# EAGLE schematic Back (EAGLE 7.6.0)
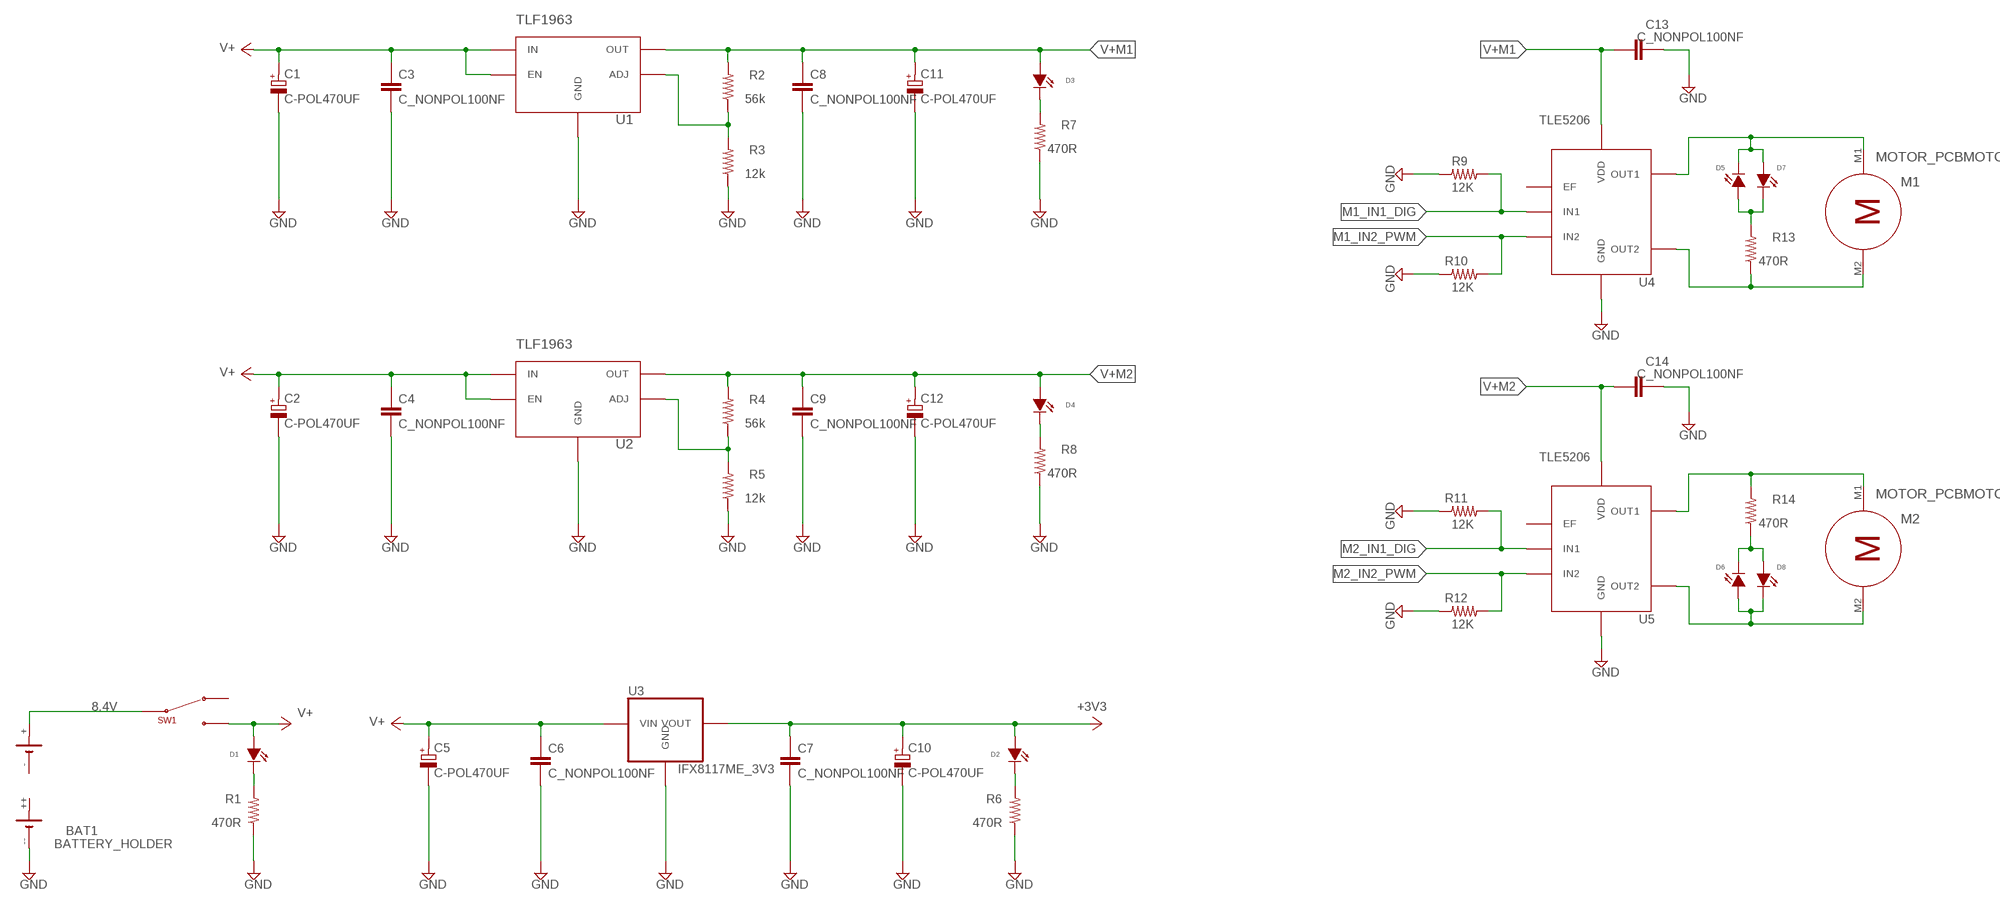
[diagram p0: schematic, sheet 1, part 1 of 2]
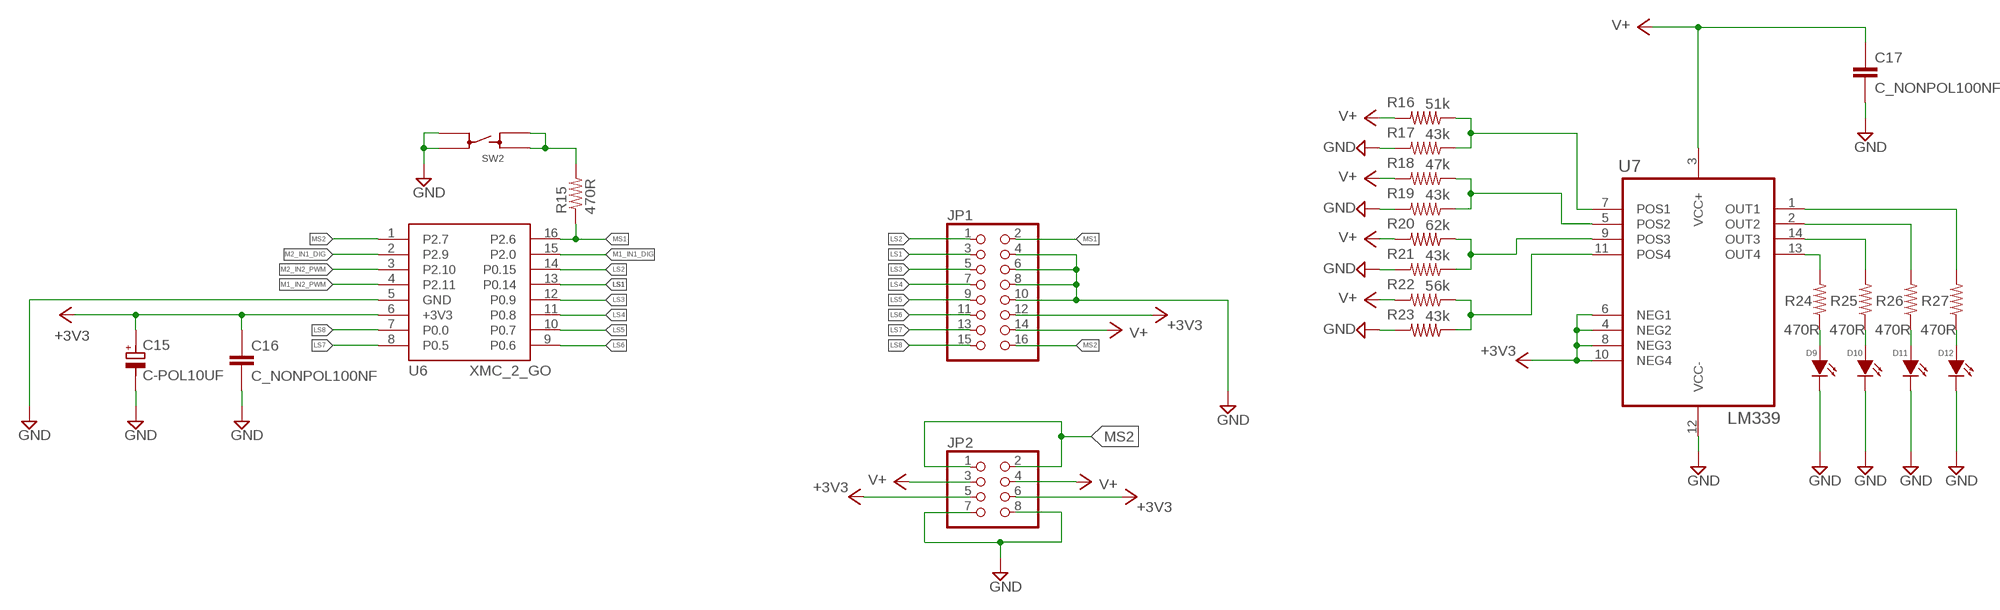
[diagram p1: schematic, sheet 1, part 2 of 2]

## Parts
BAT1  BATTERY_HOLDER  [BATT_SUPPORT_KEYSTONE]
C1  C-POL470UF  [E3,5-8]
C2  C-POL470UF  [E3,5-8]
C3  C_NONPOL100NF  [C1206]
C4  C_NONPOL100NF  [C1206]
C5  C-POL470UF  [E3,5-8]
C6  C_NONPOL100NF  [C1206]
C7  C_NONPOL100NF  [C1206]
C8  C_NONPOL100NF  [C1206]
C9  C_NONPOL100NF  [C1206]
C10  C-POL470UF  [E3,5-8]
C11  C-POL470UF  [E3,5-8]
C12  C-POL470UF  [E3,5-8]
C13  C_NONPOL100NF  [C1206]
C14  C_NONPOL100NF  [C1206]
C15  C-POL10UF  [PANASONIC_B]
C16  C_NONPOL100NF  [C1206]
C17  C_NONPOL100NF  [C1206]
D1  LED  [CHIPLED_1206]
D2  LED  [CHIPLED_1206]
D3  LED  [CHIPLED_1206]
D4  LED  [CHIPLED_1206]
D5  LED  [CHIPLED_1206]
D6  LED  [CHIPLED_1206]
D7  LED  [CHIPLED_1206]
D8  LED  [CHIPLED_1206]
D9  LED  [CHIPLED_1206]
D10  LED  [CHIPLED_1206]
D11  LED  [CHIPLED_1206]
D12  LED  [CHIPLED_1206]
JP1  PINHD-2X8  [2X08]
JP2  PINHD-2X4  [2X04]
M1  MOTOR_PCBMOTOR  [MICRO-MOTOR]
M2  MOTOR_PCBMOTOR  [MICRO-MOTOR]
R1  470R  R1206  [R1206]
R2  56k  R1206  [R1206]
R3  12k  R1206  [R1206]
R4  56k  R1206  [R1206]
R5  12k  R1206  [R1206]
R6  470R  R1206  [R1206]
R7  470R  R1206  [R1206]
R8  470R  R1206  [R1206]
R9  12K  R1206  [R1206]
R10  12K  R1206  [R1206]
R11  12K  R1206  [R1206]
R12  12K  R1206  [R1206]
R13  470R  R1206  [R1206]
R14  470R  R1206  [R1206]
R15  470R  R1206  [R1206]
R16  51k  R1206  [R1206]
R17  43k  R1206  [R1206]
R18  47k  R1206  [R1206]
R19  43k  R1206  [R1206]
R20  62k  R1206  [R1206]
R21  43k  R1206  [R1206]
R22  56k  R1206  [R1206]
R23  43k  R1206  [R1206]
R24  470R  R1206  [R1206]
R25  470R  R1206  [R1206]
R26  470R  R1206  [R1206]
R27  470R  R1206  [R1206]
SW1  SWITCH1OFF2  [MS111]
SW2  PUSH_BUTTON_SMD  [SWPB_SMD]
U1  TLF1963  [INF-PG-TO252-5-11_L_1PRIMARY]
U2  TLF1963  [INF-PG-TO252-5-11_L_1PRIMARY]
U3  IFX8117ME_3V3  [INF-PG-SOT223_SC-73_M_1PRIMARY]
U4  TLE5206  [INF-PG-TO263-7-1_L_1PRIMARY]
U5  TLE5206  [INF-PG-TO263-7-1_L_1PRIMARY]
U6  XMC_2_GO  [XMC_2_GO]
U7  LM339  [SO14]

## Nets
8.4V: BAT1.+ SW1.P$2(COM)
+3V3: C7.1 C10.+ C15.+ C16.1 D2.A JP1.12 JP2.5 JP2.6 U3.2(VOUT) U3.4(VOUT) U6.6(+3V3) U7.4(NEG2) U7.6(NEG1) U7.8(NEG3) U7.10(NEG4)
GND: BAT1.--(-1) C1.- C2.- C3.2 C4.2 C5.- C6.2 C7.2 C8.2 C9.2 C10.- C11.- C12.- C13.2 C14.2 C15.- C16.2 C17.2 D9.C(K) D10.C(K) D11.C(K) D12.C(K) JP1.4 JP1.6 JP1.8 JP1.10 JP2.7 JP2.8 R1.1 R3.1 R5.1 R6.1 R7.1 R8.1 R9.2 R10.2 R11.2 R12.2 R17.2 R19.2 R21.2 R23.2 SW2.P$1 SW2.P$2 U1.3(GND) U2.3(GND) U3.1(GND) U4.4(GND) U4.8(GND) U5.4(GND) U5.8(GND) U6.5(GND) U7.12(VCC-)
LS1: JP1.3 U6.13(P0.14)
LS2: JP1.1 U6.14(P0.15)
LS3: JP1.5 U6.12(P0.9)
LS4: JP1.7 U6.11(P0.8)
LS5: JP1.9 U6.10(P0.7)
LS6: JP1.11 U6.9(P0.6)
LS7: JP1.13 U6.8(P0.5)
LS8: JP1.15 U6.7(P0.0)
M1_IN1_DIG: R9.1 U4.3(IN1) U6.15(P2.0)
M1_IN2_PWM: R10.1 U4.5(IN2) U6.4(P2.11)
M2_IN1_DIG: R11.1 U5.3(IN1) U6.2(P2.9)
M2_IN2_PWM: R12.1 U5.5(IN2) U6.3(P2.10)
MS1: JP1.2 R15.1 U6.16(P2.6)
MS2: JP1.16 JP2.1 JP2.2 U6.1(P2.7)
N$2: R2.1 R3.2 U1.5(ADJ)
N$3: D1.C(K) R1.2
N$4: D2.C(K) R6.2
N$5: R4.1 R5.2 U2.5(ADJ)
N$6: D4.C(K) R8.2
N$7: D3.C(K) R7.2
N$8: D5.C(K) D7.A M1.M1 U4.1(OUT1)
N$10: D5.A D7.C(K) R13.2
N$11: M1.M2 R13.1 U4.7(OUT2)
N$12: D6.C(K) D8.A R14.1
N$13: M2.M1 R14.2 U5.1(OUT1)
N$14: D6.A D8.C(K) M2.M2 U5.7(OUT2)
N$23: D10.A R25.1
N$24: R15.2 SW2.P$3 SW2.P$4
N$26: R24.2 U7.13(OUT4)
N$27: R25.2 U7.14(OUT3)
N$29: R26.2 U7.2(OUT2)
N$30: R27.2 U7.1(OUT1)
N$31: D11.A R26.1
N$32: D12.A R27.1
N$33: D9.A R24.1
N$35: R16.1 R17.1 U7.7(POS1)
N$36: R18.1 R19.1 U7.5(POS2)
N$37: R20.1 R21.1 U7.9(POS3)
N$38: R22.1 R23.1 U7.11(POS4)
V+: C1.+ C2.+ C3.1 C4.1 C5.+ C6.1 C17.1 D1.A JP1.14 JP2.3 JP2.4 R16.2 R18.2 R20.2 R22.2 SW1.P$3 U1.1(EN) U1.2(IN) U2.1(EN) U2.2(IN) U3.3(VIN) U7.3(VCC+)
V+M1: C8.1 C11.+ C13.1 D3.A R2.2 U1.4(OUT) U4.6(VDD)
V+M2: C9.1 C12.+ C14.1 D4.A R4.2 U2.4(OUT) U5.6(VDD)
Unconnected: BAT1.++(+1) BAT1.- SW1.P$1 U4.2(EF) U5.2(EF)

## Library data of the parts
BAT1 = Line_Follower_LIBV3.1:BATTERY_HOLDER
C1 C2 C5 C10-C12 C15 = Line_Follower_LIBV3:C-POL
C3 C4 C6-C9 C13 C14 C16 C17 = Line_Follower_LIBV3:C_NONPOL
D1-D12 = Line_Follower_LIBV3:LED
JP1 = pinhead:PINHD-2X8: PIN HEADER
JP2 = pinhead:PINHD-2X4: PIN HEADER
M1 M2 = Line_Follower_LIBV3:MOTOR
R1-R27 = Line_Follower_LIBV3:R
SW1 = Line_Follower_LIBV3:SWITCH1OFF2
SW2 = Line_Follower_LIBV3.1:PUSH_BUTTON
U1 U2 = Line_Follower_LIBV3:TLF1963
U3 = Line_Follower_LIBV3:IFX8117ME_3V3
U4 U5 = Line_Follower_LIBV3:TLE5206
U6 = Line_Follower_LIBV3:XMC_2_GO
U7 = Line_Follower_LIBV3.1:LM339